# EAGLE design eCog119_7Segment (EAGLE 6.6.0)
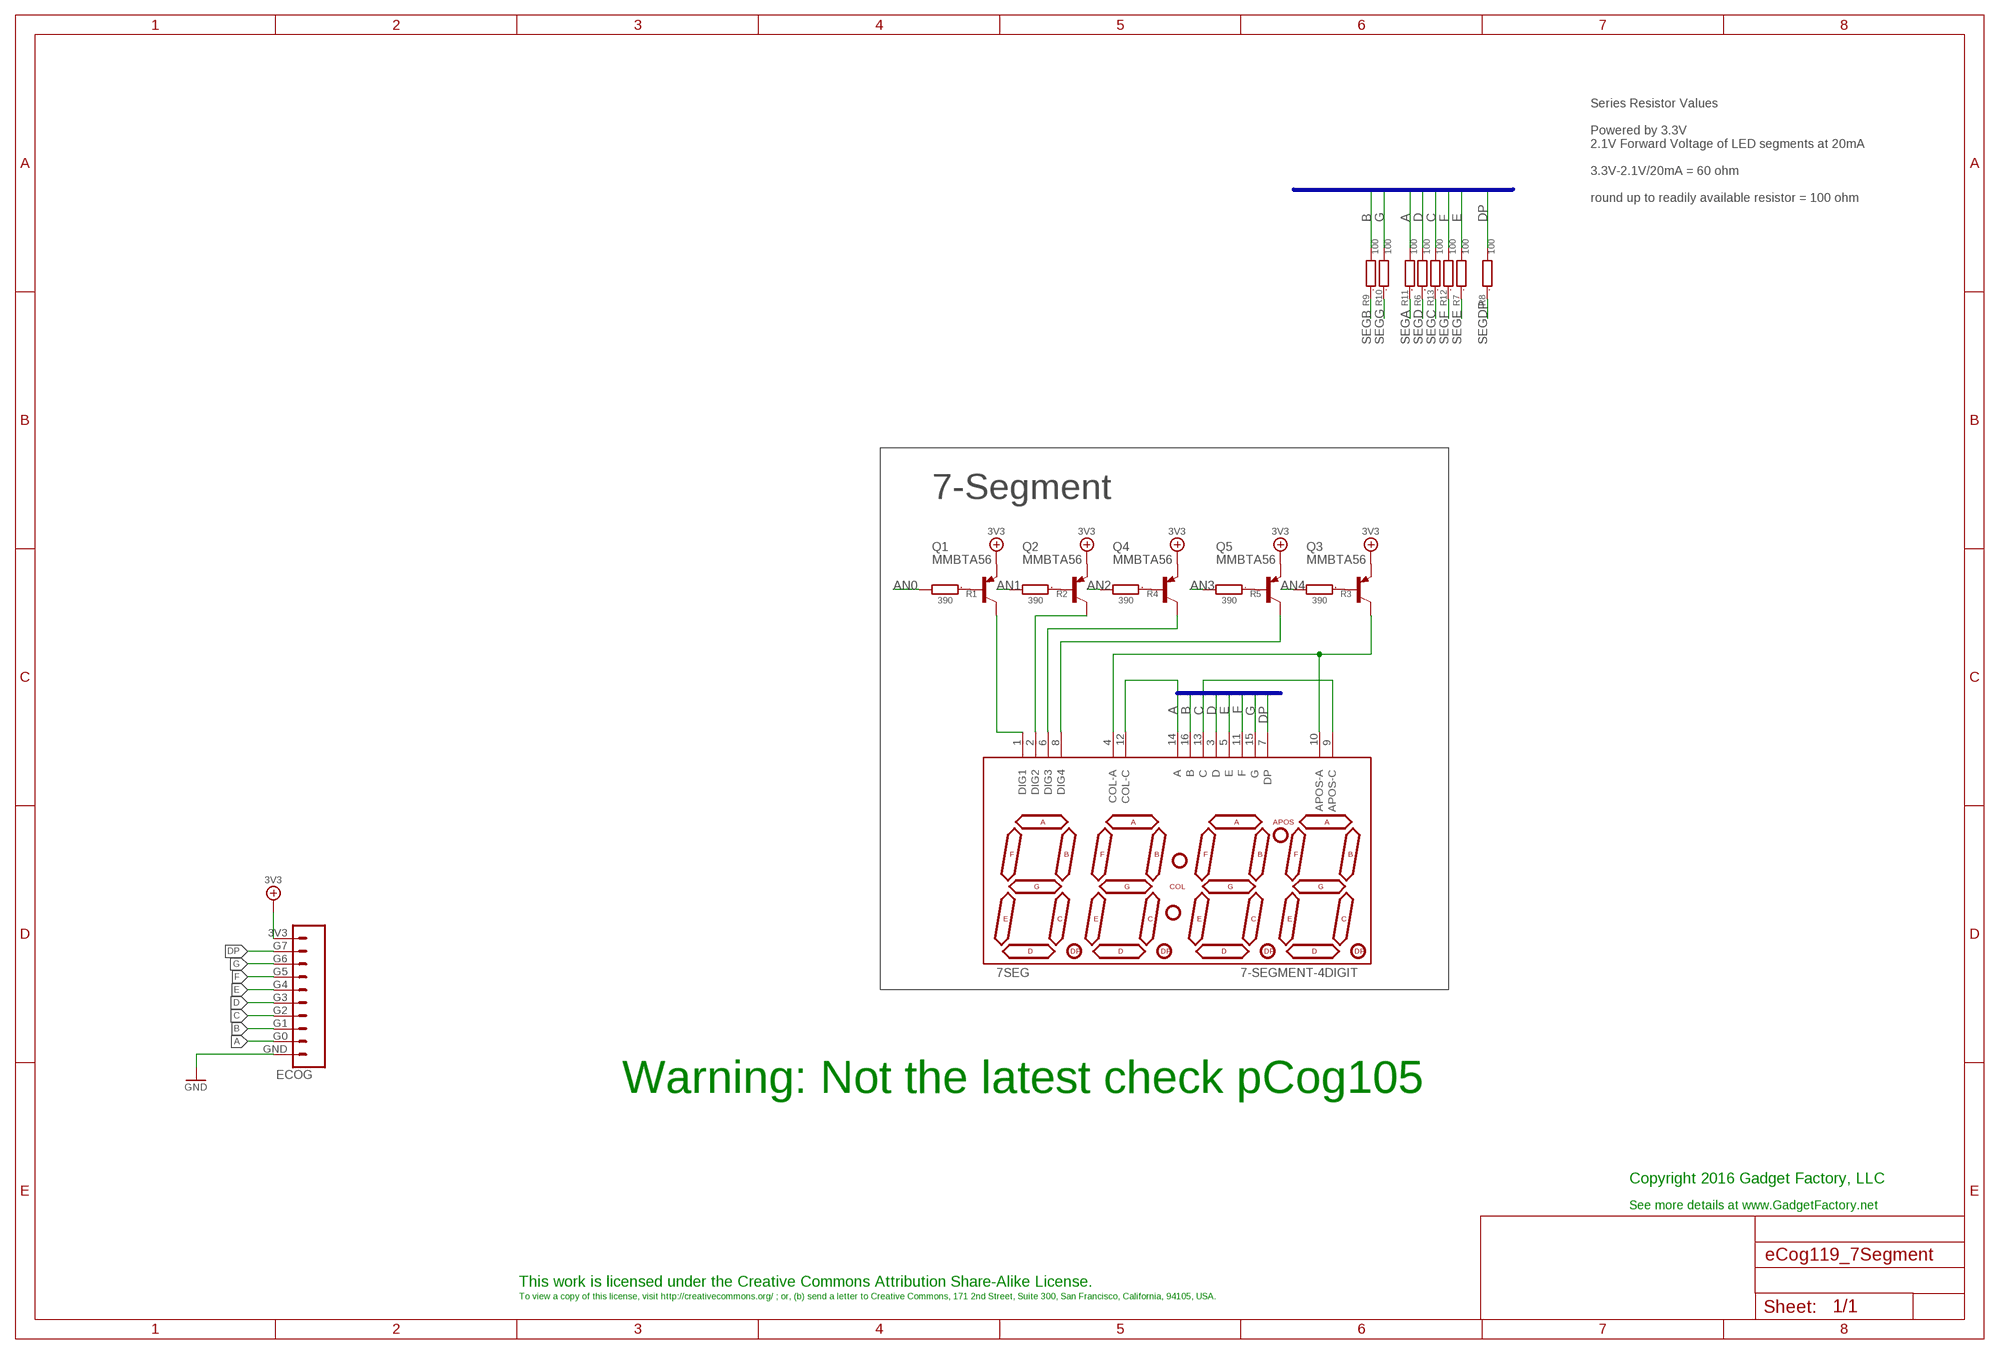
[diagram p0: schematic, sheet 1]

## Parts
7SEG  7-SEGMENT-4DIGIT  [7-SEGMENT-4DIGIT]
ECOG  ECOG_GENERAL_ROWTHROUGHOLE  [ECOG_GENERAL_TH]
Q1  MMBTA56  MMBTA56-SOT23  [SOT23]
Q2  MMBTA56  MMBTA56-SOT23  [SOT23]
Q3  MMBTA56  MMBTA56-SOT23  [SOT23]
Q4  MMBTA56  MMBTA56-SOT23  [SOT23]
Q5  MMBTA56  MMBTA56-SOT23  [SOT23]
R1  390  R0603  [0603]
R2  390  R0603  [0603]
R3  390  R0603  [0603]
R4  390  R0603  [0603]
R5  390  R0603  [0603]
R6  100  R0603  [0603]
R7  100  R0603  [0603]
R8  100  R0603  [0603]
R9  100  R0603  [0603]
R10  100  R0603  [0603]
R11  100  R0603  [0603]
R12  100  R0603  [0603]
R13  100  R0603  [0603]

## Nets
3V3: ECOG.3V3 Q1.2(E) Q2.2(E) Q3.2(E) Q4.2(E) Q5.2(E)
A: 7SEG.12(COL-C) 7SEG.14(A) ECOG.G0 R11.2
AN0: R1.2
AN1: R2.2
AN2: R4.2
AN3: R5.2
AN4: R3.2
APOS_A: 7SEG.4(COL-A) 7SEG.10(APOS-A) Q3.3(C)
B: 7SEG.16(B) ECOG.G1 R9.2
C: 7SEG.9(APOS-C) 7SEG.13(C) ECOG.G2 R13.2
D: 7SEG.3(D) ECOG.G3 R6.2
DP: 7SEG.7(DP) ECOG.G7 R8.2
E: 7SEG.5(E) ECOG.G4 R7.2
F: 7SEG.11(F) ECOG.G5 R12.2
G: 7SEG.15(G) ECOG.G6 R10.2
GND: ECOG.GND
N$2: Q1.1(B) R1.1
N$3: Q2.1(B) R2.1
N$6: Q4.1(B) R4.1
N$7: Q5.1(B) R5.1
N$8: Q3.1(B) R3.1
N$29: 7SEG.1(DIG1) Q1.3(C)
N$30: 7SEG.2(DIG2) Q2.3(C)
N$31: 7SEG.6(DIG3) Q4.3(C)
N$32: 7SEG.8(DIG4) Q5.3(C)
SEGA: R11.1
SEGB: R9.1
SEGC: R13.1
SEGD: R6.1
SEGDP: R8.1
SEGE: R7.1
SEGF: R12.1
SEGG: R10.1

## Buses
A,B,C,D,E,F,G,DP,COL_A,COL_C,APOS_A,APOS_C
RED[0..2],GREEN[0..2],BLUE[0..1],VERTICAL_SYNC,HORIZONTAL_SYNC,AUDIO,SPI_SCLK,SPI_DIN,SPI_DOUT,SPI_CS,JOY_SELECT,JOY_RIGHT,JOY_LEFT,JOY_DOWN,JOY_UP,AN[0..3],A,B,C,D,E,F,G,DP

## Notes on the sheet
- Series Resistor Values
  
  Powered by 3.3V
  2.1V Forward Voltage of LED segments at 20mA
  
  3.3V-2.1V/20mA = 60 ohm
  
  round up to readily available resistor = 100 ohm
- 7-Segment
- Warning: Not the latest check pCog105
- Copyright 2016 Gadget Factory, LLC
- See more details at www.GadgetFactory.net
- This work is licensed under the Creative Commons Attribution Share-Alike License.
- To view a copy of this license, visit http://creativecommons.org/ ; or, (b) send a letter to Creative Commons, 171 2nd Street, Suite 300, San Francisco, California, 94105, USA.

## Library data of the parts
7SEG = GadgetFactory_Pub_1_0:7-SEGMENT-4DIGIT: This is a part for the 4-Digit 7-segment LEDs from Young Sun. Different from the Digikey LEDs, all 16 pins are used. The LONGPADS Variant is used for a test jig, but you may like it because there is more pad to solder to. If you are concerned about routing space, the standard works just fine though.; PARTNO: AL-D4012BWSR/58-040C
ECOG = eCogs:ECOG_GENERAL_ROW
Q1-Q5 = transistor-pnp:*-?: PNP Transistor; PARTNO: MMBTA56
R1-R13 = GadgetFactory:R: RESISTOR, European symbol; PARTNO: CRCW0603100RJNEA

## Board
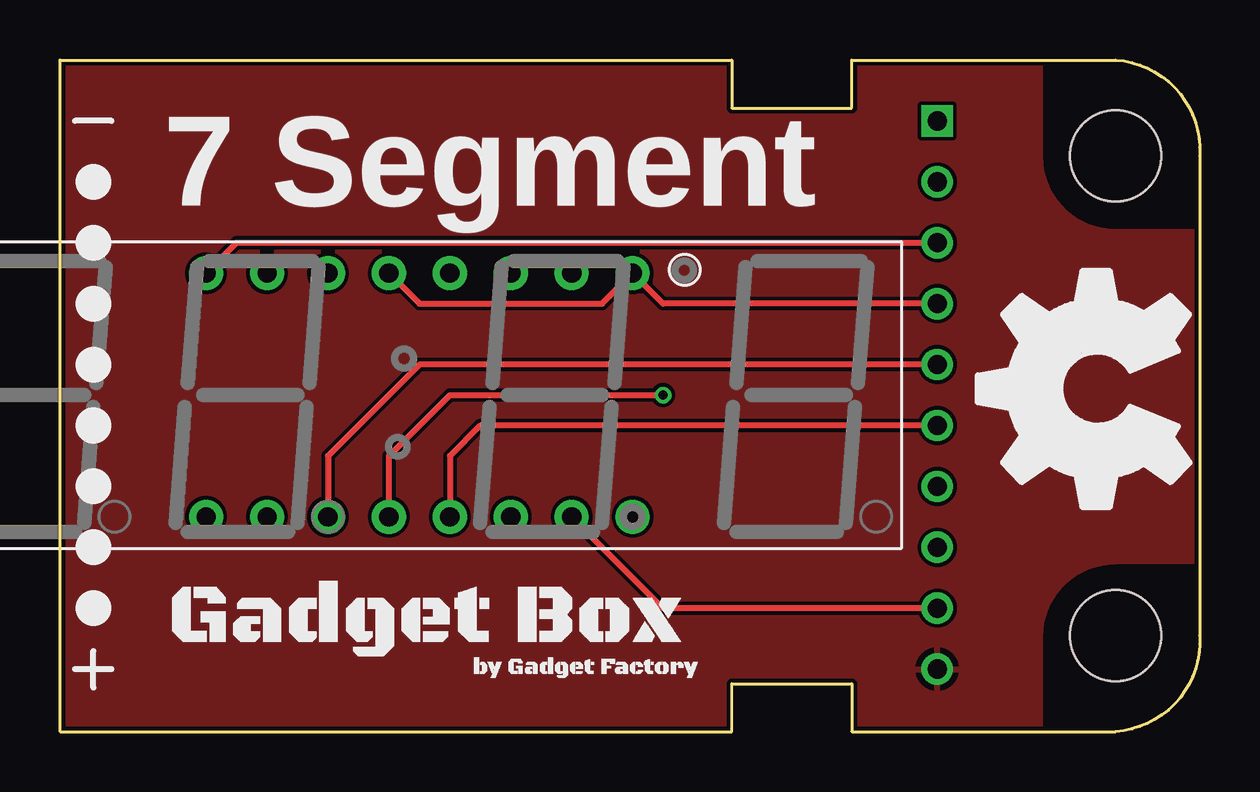
[diagram p1: board, top side]
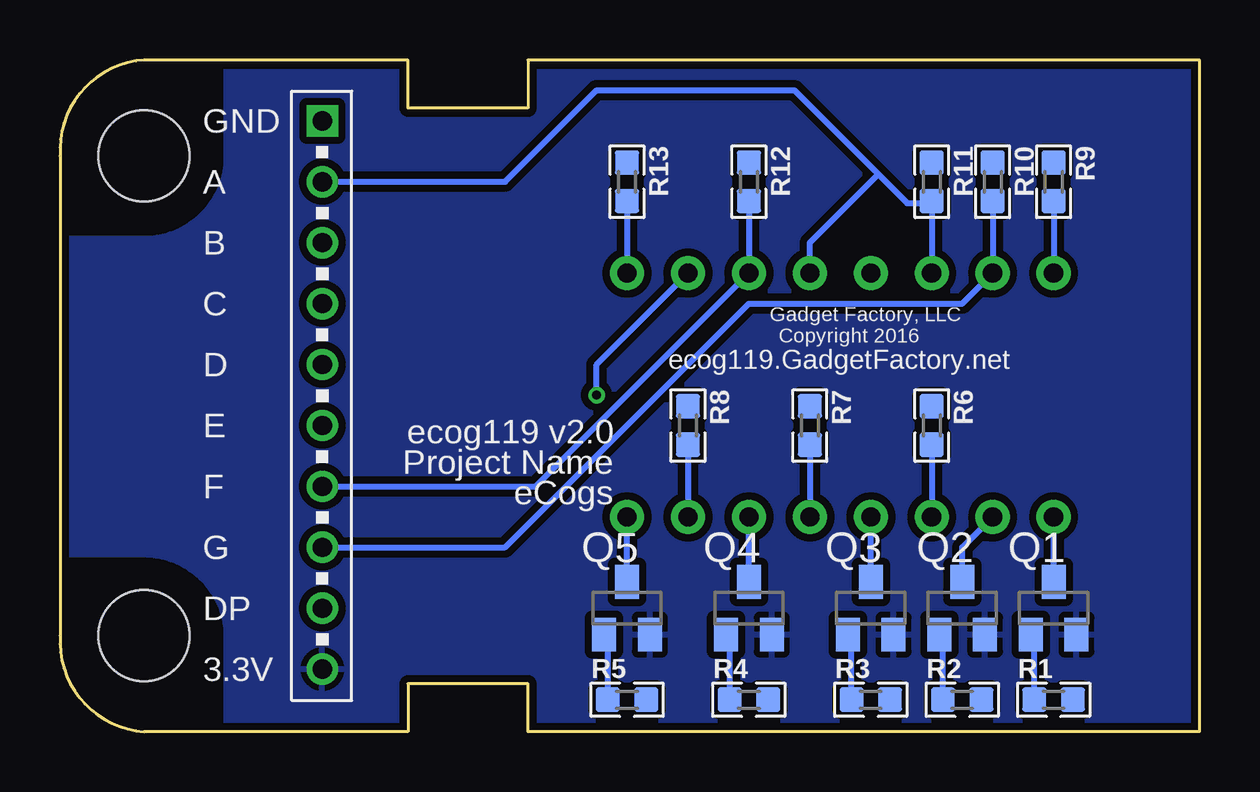
[diagram p2: board, bottom side, seen from below]

Size 47.51 x 28 mm. Coordinates in mm from the lower left corner, seen from the top.
Copper layers (1*16): Top 0.035mm / dielectric 1.5mm / Bottom 0.035mm
Design rules "hackvana *": minimum track width 6mil, minimum drill 0.3mm, track to track 6mil, track to pad 6mil, pad to pad 6mil, via to via 6mil, smd to smd 0mil, copper to edge 6mil, drill to drill 6mil, minimum pad ring 10mil, minimum via ring 6mil, stop-mask expansion 2mil, vias tented up to drill 100mil, thermal gap 10mil

### Footprints (pad centres in the part's own frame; a part is rotated, then mirrored left to right if it is on the bottom)
7-SEGMENT-4DIGIT = drill 0.8 pad 1.422: 1 -8.89,-5.08; 2 -6.35,-5.08; 3 -3.81,-5.08; 4 -1.27,-5.08; 5 1.27,-5.08; 6 3.81,-5.08; 7 6.35,-5.08; 8 8.89,-5.08; 9 8.89,5.08; 10 6.35,5.08; 11 3.81,5.08; 12 1.27,5.08; 13 -1.27,5.08; 14 -3.81,5.08; 15 -6.35,5.08; 16 -8.89,5.08
ECOG_GENERAL_TH = drill 0.8: 3V3 11.43,25.4; G0 11.43,5.08; G1 11.43,7.62; G2 11.43,10.16; G3 11.43,12.7; G4 11.43,15.24; G5 11.43,17.78; G6 11.43,20.32; G7 11.43,22.86 | drill 0.8 square: GND 11.43,2.54 | hole 3.8: 4,24; 4,4
SOT23 = smd 1 x 1.4: 1 -0.95,-1.1; 2 0.95,-1.1; 3 0,1.1
0603 = smd 1 x 1: 1 -0.8,0; 2 0.8,0

### Placement (x,y rotation side)
7SEG  14.98,14.03 0 top
ECOG  48,28 180 top
Q1  6.09,5.14 0 bottom
Q2  9.9,5.14 0 bottom
Q3  13.71,5.14 0 bottom
Q4  18.79,5.14 0 bottom
Q5  23.87,5.14 0 bottom
R1  6.09,1.33 0 bottom
R2  9.9,1.33 0 bottom
R3  13.71,1.33 0 bottom
R4  18.79,1.33 0 bottom
R5  23.87,1.33 0 bottom
R6  11.17,12.76 270 bottom
R7  16.25,12.76 270 bottom
R8  21.33,12.76 270 bottom
R9  6.09,22.92 270 bottom
R10  8.63,22.92 270 bottom
R11  11.17,22.92 270 bottom
R12  18.79,22.92 270 bottom
R13  23.87,22.92 270 bottom
U$1  [LEGEND_DIO]  1.39,5.14 180 top
U$2  [LEGEND_DIO]  1.39,7.68 180 top
U$3  [OSHW_FILLX350_NOTEXT]  47.11,9.33 90 top
U$4  [LEGEND_DIO]  1.39,10.22 180 top
U$5  [LEGEND_DIO]  1.39,12.76 180 top
U$6  [LEGEND_DIO]  1.39,15.3 180 top
U$7  [LEGEND_DIO]  1.39,17.84 180 top
U$8  [LEGEND_DIO]  1.39,20.38 180 top
U$9  [LEGEND_DIO]  1.39,22.92 180 top
U$10  [GADGETBOX_SMALL]  15.36,4.63 0 top

### Tracks (layer width: path | path; a pad name or v marks a point on that pad's centre or on a via)
3V3
  pour Top: 49,-1 -1,-1 -1,29 49,29
  pour Bottom (isolate 0.305): 50,-2 -2,-2 -2,30 50,30
A
  Bottom 0.254: 7SEG.14 R11.2 11.26,22.03 12.19,22.03 13.39,23.24 | ECOG.G0 28.95,22.92 25.14,26.73 16.89,26.73 13.39,23.24 | 7SEG.12 16.25,20.38 13.39,23.24
APOS_A  (via drill 0.38)
  Top 0.254: 7SEG.4 13.71,11.49 16.25,14.03 v25.14,14.03
  Bottom 0.254: Q3.3 7SEG.4 | v25.14,14.03 25.14,15.3 7SEG.10
B
  Top 0.254: 7SEG.16 7.36,20.38 ECOG.G1
  Bottom 0.254: R9.2 7SEG.16
C
  Top 0.254: ECOG.G2 25.14,17.84 7SEG.9 22.6,17.84 14.98,17.84 7SEG.13
  Bottom 0.254: R13.2 7SEG.9
D
  Top 0.254: ECOG.G3 14.98,15.3 11.17,11.49 7SEG.3
  Bottom 0.254: R6.2 7SEG.3
DP
  Top 0.254: ECOG.G7 25.14,5.14 7SEG.7
  Bottom 0.254: R8.2 7SEG.7
E
  Top 0.254: ECOG.G4 17.52,12.76 16.25,11.49 7SEG.5
  Bottom 0.254: R7.2 7SEG.5
F
  Bottom 0.254: R12.2 7SEG.11 27.68,10.22 ECOG.G5
G
  Bottom 0.254: R10.2 7SEG.15 9.9,17.84 18.79,17.84 28.95,7.68 ECOG.G6
N$2
  Bottom 0.254: R1.1 6.89,3.89 Q1.1
N$3
  Bottom 0.254: R2.1 10.7,3.89 Q2.1
N$6
  Bottom 0.254: R4.1 19.59,3.89 Q4.1
N$7
  Bottom 0.254: R5.1 24.67,3.89 Q5.1
N$8
  Bottom 0.254: R3.1 14.51,3.89 Q3.1
N$29
  Bottom 0.254: Q1.3 7SEG.1
N$30
  Bottom 0.254: Q2.3 9.9,7.68 7SEG.2
N$31
  Bottom 0.254: Q4.3 7SEG.6
N$32
  Bottom 0.254: Q5.3 7SEG.8

### Text on the board
tPlace: 7 Segment
bPlace: GND | A | B | Gadget Factory, LLC | Copyright 2016 | C | ecog119.GadgetFactory.net | D | ecog119 v2.0 | Project Name | E | eCogs | F | G | DP | 3.3V